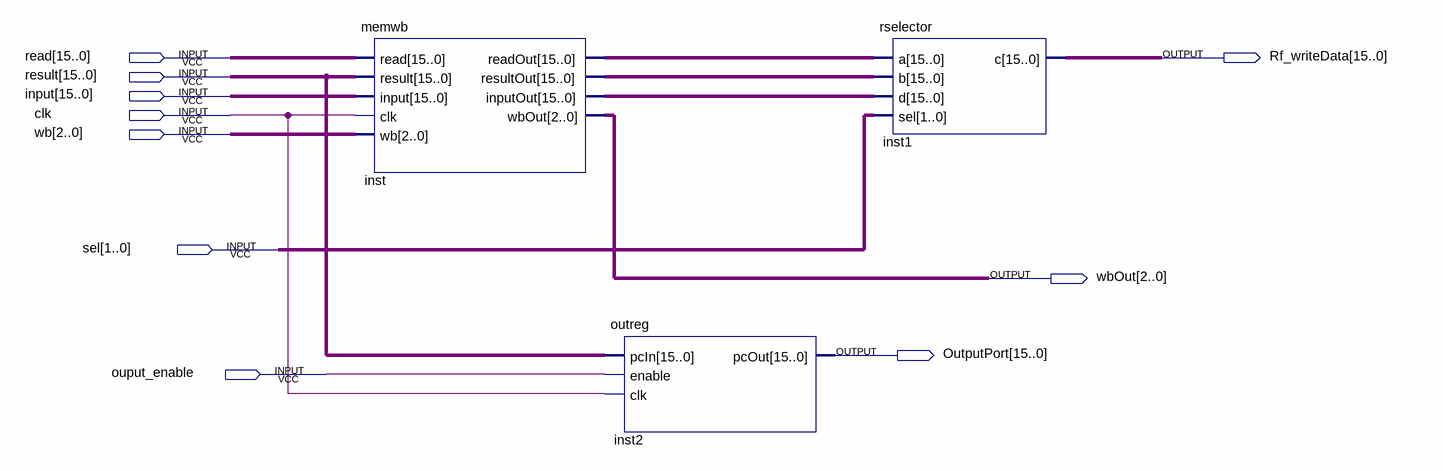
[diagram p0: schematic sheet]
// Quartus schematic stage4.bdf as structural Verilog: 3 symbols, 10 pins
module stage4 (
  input  [15:0] read,
  input  [15:0] result,
  input  [15:0] \input ,
  input  clk,
  input  [2:0] wb,
  input  [1:0] sel,
  input  ouput_enable,
  output [15:0] Rf_writeData,
  output [2:0] wbOut,
  output [15:0] OutputPort
);

  wire [15:0] inst_inputout, inst_readout, inst_resultout;

  memwb inst (
    .read(read), .result(result), .\input (\input ), .clk(clk), .wb(wb), .readOut(inst_readout),
    .resultOut(inst_resultout), .inputOut(inst_inputout), .wbOut(wbOut));
  outreg inst2 (.pcIn(result), .enable(ouput_enable), .clk(clk), .pcOut(OutputPort));
  rselector inst1 (.a(inst_readout), .b(inst_resultout), .d(inst_inputout), .sel(sel), .c(Rf_writeData));
endmodule
